# EAGLE design Alimv1 (EAGLE 9.0.1)
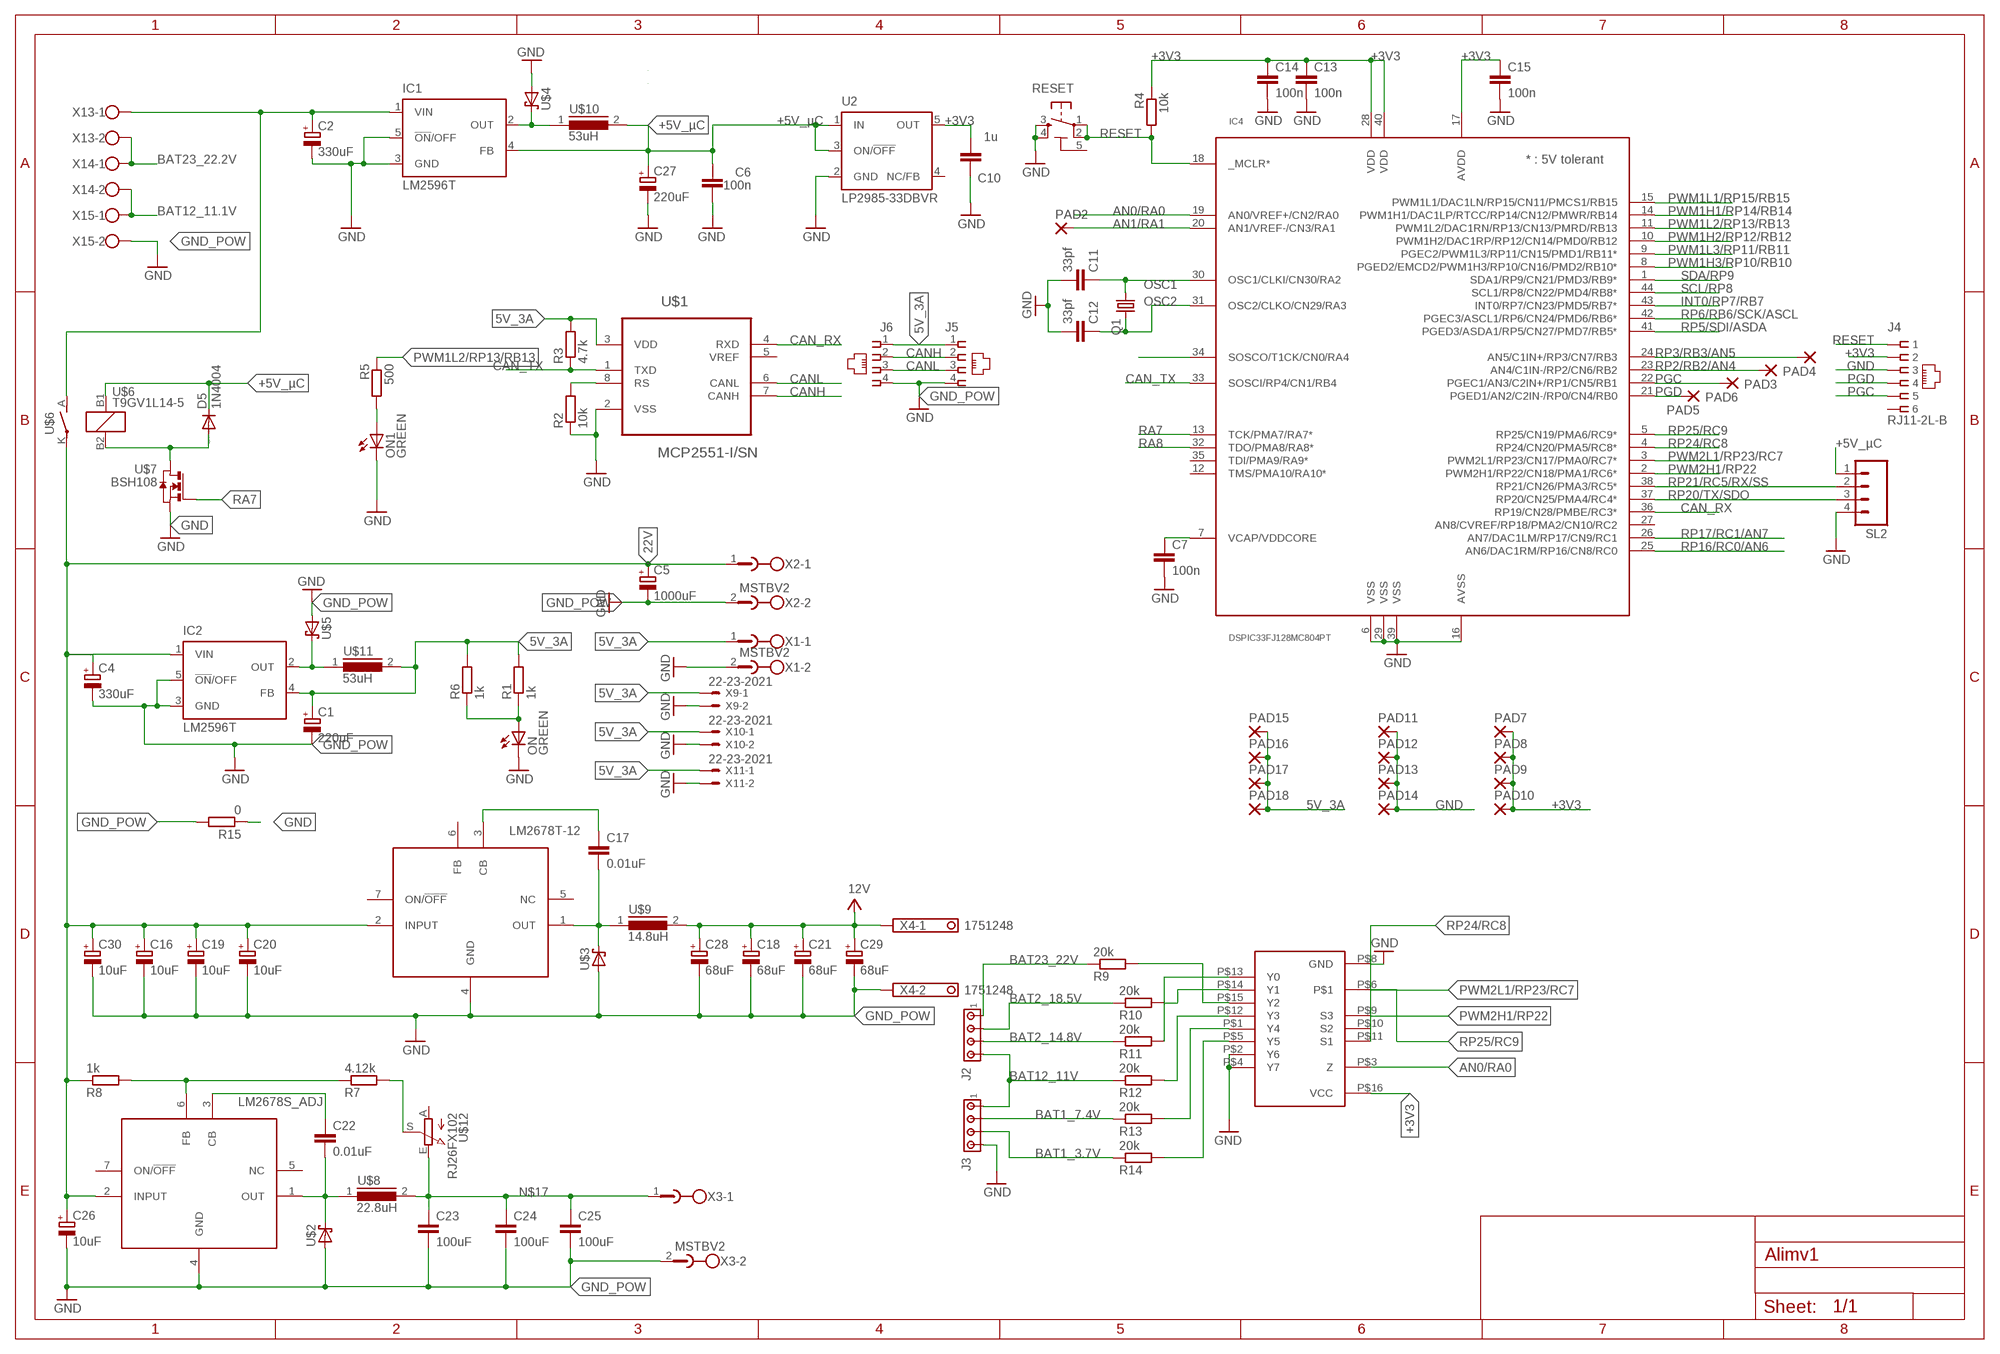
[diagram p0: schematic, sheet 1]

## Parts
C1  220uF  CPOL-EUD/7343-31W  [D/7343-31W]
C2  330uF  CPOL-EUD/7343-31W  [D/7343-31W]
C4  330uF  CPOL-EUD/7343-31W  [D/7343-31W]
C5  1000uF  CPOL-EUE7.5-16  [E7,5-16]
C6  100n  C-EU0603-RND  [C0603-ROUND]
C7  100n  C-EUC0603K  [C0603K]
C10  1u  C-EU0603-RND  [C0603-ROUND]
C11  33pf  C-EUC0603  [C0603]
C12  33pf  C-EUC0603  [C0603]
C13  100n  C-EUC0603  [C0603]
C14  100n  C-EUC0603  [C0603]
C15  100n  C-EUC0603  [C0603]
C16  10uF  CPOL-EUD/7343-31W  [D/7343-31W]
C17  0.01uF  C-EUC0603  [C0603]
C18  68uF  CPOL-EUD/7343-31W  [D/7343-31W]
C19  10uF  CPOL-EUD/7343-31W  [D/7343-31W]
C20  10uF  CPOL-EUD/7343-31W  [D/7343-31W]
C21  68uF  CPOL-EUD/7343-31W  [D/7343-31W]
C22  0.01uF  C-EUC0603  [C0603]
C23  100uF  C-EUC1210  [C1210]
C24  100uF  C-EUC1210  [C1210]
C25  100uF  C-EUC1210  [C1210]
C26  10uF  CPOL-EUD/7343-31W  [D/7343-31W]
C27  220uF  CPOL-EUD/7343-31W  [D/7343-31W]
C28  68uF  CPOL-EUD/7343-31W  [D/7343-31W]
C29  68uF  CPOL-EUD/7343-31W  [D/7343-31W]
C30  10uF  CPOL-EUD/7343-31W  [D/7343-31W]
D5  1N4004  [DO41-10]
IC1  LM2596T  [T05D]
IC2  LM2596T  [T05D]
IC4  DSPIC33FJ128MC804PT  [TQFP44]
J2  MTA04-100  [10X04MTA]
J3  MTA04-100  [10X04MTA]
J4  RJ11-2L-B  [RJ11-NO_SHIELD]
J5  520249-2  [520249-2]
J6  520249-2  [520249-2]
LM2678S_ADJ  LM2678  [TO-220-7]
LM2678T-12  LM2678  [TO-220-7]
ON  GREEN  LEDCHIP-LED0805  [CHIP-LED0805]
ON1  GREEN  LEDCHIP-LED0805  [CHIP-LED0805]
PAD2  1,6/0,9  [1,6/0,9]
PAD3  1,6/0,9  [1,6/0,9]
PAD4  1,6/0,9  [1,6/0,9]
PAD5  1,6/0,9  [1,6/0,9]
PAD6  1,6/0,9  [1,6/0,9]
PAD7  1,6/0,9  [1,6/0,9]
PAD8  1,6/0,9  [1,6/0,9]
PAD9  1,6/0,9  [1,6/0,9]
PAD10  1,6/0,9  [1,6/0,9]
PAD11  1,6/0,9  [1,6/0,9]
PAD12  1,6/0,9  [1,6/0,9]
PAD13  1,6/0,9  [1,6/0,9]
PAD14  1,6/0,9  [1,6/0,9]
PAD15  1,6/0,9  [1,6/0,9]
PAD16  1,6/0,9  [1,6/0,9]
PAD17  1,6/0,9  [1,6/0,9]
PAD18  1,6/0,9  [1,6/0,9]
Q1  CRYSTALSM49  [SM49]
R1  1k  R-EU_R0805  [R0805]
R2  10k  R-EU_R0805  [R0805]
R3  4.7k  R-EU_R0805  [R0805]
R4  10k  R-EU_R0805  [R0805]
R5  500  R-EU_R0805  [R0805]
R6  1k  R-EU_R0805  [R0805]
R7  4.12k  R-EU_R0805  [R0805]
R8  1k  R-EU_R0805  [R0805]
R9  20k  R-EU_R0805  [R0805]
R10  20k  R-EU_R0805  [R0805]
R11  20k  R-EU_R0805  [R0805]
R12  20k  R-EU_R0805  [R0805]
R13  20k  R-EU_R0805  [R0805]
R14  20k  R-EU_R0805  [R0805]
R15  0  R-EU_R0805  [R0805]
RESET  TS42031-160R-TR-7260  TS42  [TS42]
SL2  M04  [04P]
U2  LP2985-33DBVR  LP2985-XXDBVR33  [SOT23-DBV]
U$1  MCP2551-I/SN  [SOIC127P600X175-8N]
U$2  SCHOTTKY_TO220  [TO220ACS]
U$3  SCHOTTKY_TO220  [TO220ACS]
U$4  1N5820  [DO-201AD]
U$5  1N5820  [DO-201AD]
U$6  T9GV1L14-5  [T9G]
U$7  BSH108  [SOT23]
U$8  22.8uH  P0841NL  [KM-3.0]
U$9  14.8uH  P0846NL  [KM-2.1]
U$10  53uH  PE-54039NL  [KM-3.0_5V3A]
U$11  53uH  PE-54039NL  [KM-3.0_5V3A]
U$12  RJ26FX102  [RJ6S]
U$13  NX3L4051PW  [SOT403]
X1  MSTBV2  [MSTBV2]
X2  MSTBV2  [MSTBV2]
X3  MSTBV2  [MSTBV2]
X4  1751248  [1751248]
X9  22-23-2021  [22-23-2021]
X10  22-23-2021  [22-23-2021]
X11  22-23-2021  [22-23-2021]
X13  W237-102  [W237-102]
X14  W237-102  [W237-102]
X15  W237-102  [W237-102]

## Nets
5V_3A: C1.+ IC2.4(FB) J5.1 J6.1 PAD15.1(P) PAD16.1(P) PAD17.1(P) PAD18.1(P) R1.2 R3.2 R6.2 U$1.3(VDD) U$11.2 X1.1 X9.1 X10.1 X11.1
22V: C4.+ C5.+ C16.+ C19.+ C20.+ C26.+ C30.+ IC2.1(VIN) LM2678S_ADJ.2(INPUT) LM2678T-12.2(INPUT) R8.1 U$6.K(P) X2.1
+3V3: C10.2 C13.1 C14.1 C15.1 IC4.17(AVDD) IC4.28(VDD) IC4.40(VDD) J4.2 PAD7.1(P) PAD8.1(P) PAD9.1(P) PAD10.1(P) R4.1 U2.5(OUT) U$13.P$16(VCC)
+5V_µC: C6.2 C27.+ D5.C IC1.4(FB) SL2.1 U2.1(IN) U2.3(ON/!OFF) U$6.B1 U$10.2
AN0/RA0: IC4.19(AN0/VREF+/CN2/RA0) U$13.P$3(Z)
AN1/RA1: IC4.20(AN1/VREF-/CN3/RA1) PAD2.1(P)
BAT1_3.7V: J3.3 R14.1
BAT1_7.4V: J3.2 R13.1
BAT2_14.8V: J2.3 R11.1
BAT2_18.5V: J2.2 R10.1
BAT3+: C2.+ IC1.1(VIN) U$6.A(S) X13.1
BAT12_11.1V: X14.2 X15.1
BAT12_11V: J2.4 J3.1 R12.1
BAT23_22.2V: X13.2 X14.1
BAT23_22V: J2.1 R9.1
CAN_RX: IC4.36(RP19/CN28/PMBE/RC3*) U$1.4(RXD)
CAN_TX: IC4.33(SOSCI/RP4/CN1/RB4) R3.1 U$1.1(TXD)
CANH: J5.2 J6.2 U$1.7(CANH)
CANL: J5.3 J6.3 U$1.6(CANL)
GND: C2.- C6.1 C7.2 C10.1 C11.2 C12.2 C13.2 C14.2 C15.2 C27.- IC1.3(GND) IC1.5(!ON!/OFF) IC4.6(VSS) IC4.16(AVSS) IC4.29(VSS) IC4.39(VSS) J3.4 J4.3 ON1.C ON.C PAD11.1(P) PAD12.1(P) PAD13.1(P) PAD14.1(P) R2.1 R15.1 RESET.3 RESET.4 SL2.4 U2.2(GND) U$1.2(VSS) U$4.A U$7.2(S) U$13.P$2(Y6) U$13.P$4(Y7) U$13.P$8(GND)
GND_POW: C1.- C4.- C5.- C16.- C18.- C19.- C20.- C21.- C23.2 C24.2 C25.2 C26.- C28.- C29.- C30.- IC2.3(GND) IC2.5(!ON!/OFF) J5.4 J6.4 LM2678S_ADJ.4(GND) LM2678T-12.4(GND) R15.2 U$2.A U$3.A U$5.A X1.2 X2.2 X3.2 X4.2 X9.2 X10.2 X11.2 X15.2 ; supply symbol labelled GND
INT0/RP7/RB7: IC4.43(INT0/RP7/CN23/PMD5/RB7*)
N$1: ON1.A R5.2
N$2: ON.A R1.1 R6.1
N$4: R9.2 U$13.P$15(Y2)
N$5: C7.1 IC4.7(VCAP/VDDCORE)
N$6: R11.2 U$13.P$13(Y0)
N$7: LM2678S_ADJ.6(FB) R7.1 R8.2
N$8: R2.2 U$1.8(RS)
N$9: IC2.2(OUT) U$5.C U$11.1
N$10: IC4.34(SOSCO/T1CK/CN0/RA4)
N$11: C17.2 LM2678T-12.1(OUT) U$3.C U$9.1
N$12: IC1.2(OUT) U$4.C U$10.1
N$13: C22.1 LM2678S_ADJ.3(CB)
N$14: C17.1 LM2678T-12.3(CB)
N$15: R12.2 U$13.P$12(Y3)
N$16: C22.2 LM2678S_ADJ.1(OUT) U$2.C U$8.1
N$17: C23.1 C24.1 C25.1 U$8.2 U$12.E X3.1
N$18: D5.A U$6.B2 U$7.3(D)
N$19: R7.2 U$12.S
N$20: R13.2 U$13.P$1(Y4)
N$21: R10.2 U$13.P$14(Y1)
N$22: R14.2 U$13.P$5(Y5)
OSC1: C11.1 IC4.30(OSC1/CLKI/CN30/RA2) Q1.1
OSC2: C12.1 IC4.31(OSC2/CLKO/CN29/RA3) Q1.2
PGC: IC4.22(PGEC1/AN3/C2IN+/RP1/CN5/RB1) J4.5 PAD6.1(P)
PGD: IC4.21(PGED1/AN2/C2IN-/RP0/CN4/RB0) J4.4 PAD5.1(P)
PWM1H1/RP14/RB14: IC4.14(PWM1H1/DAC1LP/RTCC/RP14/CN12/PMWR/RB14)
PWM1H2/RP12/RB12: IC4.10(PWM1H2/DAC1RP/RP12/CN14/PMD0/RB12)
PWM1H3/RP10/RB10: IC4.8(PGED2/EMCD2/PWM1H3/RP10/CN16/PMD2/RB10*)
PWM1L1/RP15/RB15: IC4.15(PWM1L1/DAC1LN/RP15/CN11/PMCS1/RB15)
PWM1L2/RP13/RB13: IC4.11(PWM1L2/DAC1RN/RP13/CN13/PMRD/RB13) R5.1
PWM1L3/RP11/RB11: IC4.9(PGEC2/PWM1L3/RP11/CN15/PMD1/RB11*)
PWM2H1/RP22: IC4.2(PWM2H1/RP22/CN18/PMA1/RC6*) U$13.P$9(S3)
PWM2L1/RP23/RC7: IC4.3(PWM2L1/RP23/CN17/PMA0/RC7*) U$13.P$10(S2)
RA7: IC4.13(TCK/PMA7/RA7*) U$7.1(G)
RA8: IC4.32(TDO/PMA8/RA8*)
RESET: IC4.18(_MCLR*) J4.1 R4.2 RESET.1 RESET.2
RP2/RB2/AN4: IC4.23(AN4/C1IN-/RP2/CN6/RB2) PAD3.1(P)
RP3/RB3/AN5: IC4.24(AN5/C1IN+/RP3/CN7/RB3) PAD4.1(P)
RP5/SDI/ASDA: IC4.41(PGED3/ASDA1/RP5/CN27/PMD7/RB5*)
RP6/RB6/SCK/ASCL: IC4.42(PGEC3/ASCL1/RP6/CN24/PMD6/RB6*)
RP16/RC0/AN6: IC4.25(AN6/DAC1RM/RP16/CN8/RC0)
RP17/RC1/AN7: IC4.26(AN7/DAC1LM/RP17/CN9/RC1)
RP20/TX/SDO: IC4.37(RP20/CN25/PMA4/RC4*) SL2.3
RP21/RC5/RX/SS: IC4.38(RP21/CN26/PMA3/RC5*) SL2.2
RP24/RC8: IC4.4(RP24/CN20/PMA5/RC8*) U$13.P$11(S1)
RP25/RC9: IC4.5(RP25/CN19/PMA6/RC9*) U$13.P$6
SCL/RP8: IC4.44(SCL1/RP8/CN22/PMD4/RB8*)
SDA/RP9: IC4.1(SDA1/RP9/CN21/PMD3/RB9*)
V+: C18.+ C21.+ C28.+ C29.+ U$9.2 X4.1 ; supply symbol labelled 12V
Unconnected: IC4.12(TMS/PMA10/RA10*) IC4.27(AN8/CVREF/RP18/PMA2/CN10/RC2) IC4.35(TDI/PMA9/RA9*) J4.6 LM2678S_ADJ.5(NC) LM2678S_ADJ.7(ON/!OFF!) LM2678T-12.5(NC) LM2678T-12.6(FB) LM2678T-12.7(ON/!OFF!) U2.4(NC/FB) U$1.5(VREF) U$12.A

## Power pins joined to a net without a drawn wire
5-GND: RESET.5(5-GND)

## Library data of the parts
C1 C27 = rcl:CPOL-EU: POLARIZED CAPACITOR, European symbol; OC_FARNELL: 2283872; SPICEPREFIX: C
C2 C4 = rcl:CPOL-EU: POLARIZED CAPACITOR, European symbol; OC_FARNELL: 1135198; SPICEPREFIX: C
C5 = rcl:CPOL-EU: POLARIZED CAPACITOR, European symbol; SPICEPREFIX: C
C6 C7 = SmartPrj:C-EU: CAPACITOR, European symbol; OC_FARNELL: 2210925
C10 = SmartPrj:C-EU: CAPACITOR, European symbol; OC_FARNELL: 2346901
C11 C12 = LibPerso:C-EU: CAPACITOR, European symbol; OC_FARNELL: 1740598
C13-C15 = LibPerso:C-EU: CAPACITOR, European symbol; OC_FARNELL: 2210925
C16 C19 C20 C30 = rcl:CPOL-EU: POLARIZED CAPACITOR, European symbol; OC_FARNELL: 2424754; SPICEPREFIX: C
C17 C22 = rcl:C-EU: CAPACITOR, European symbol; SPICEPREFIX: C
C18 C21 C28 C29 = rcl:CPOL-EU: POLARIZED CAPACITOR, European symbol; OC_FARNELL: 2524603; SPICEPREFIX: C
C23-C25 = rcl:C-EU: CAPACITOR, European symbol; OC_FARNELL: 1658510; SPICEPREFIX: C
C26 = rcl:CPOL-EU: POLARIZED CAPACITOR, European symbol; OC_FARNELL: 1432608; SPICEPREFIX: C
D5 = diode:1N4004: DIODE general purpose rectifier, 1 A
IC1 IC2 = national-semiconductor:LM2596: SIMPLE SWITCHER® Power Converter 150 kHz 3A Step-Down Voltage Regulator Source: http://www.national.com/ds/LM/LM2596.pdf; MPN: LM2596T-ADJ/LF02; OC_FARNELL: 9494162; OC_NEWARK: 65K5910
IC4 = microchip-dspic33:DSPIC33F*04
J2 J3 = con-amp:MTA04-100: AMP connector
J4 = LibPerso:RJ11: CORCOM Modular RJ Jacks No Shield Source: www.tycoelectronics.com .. ENG_DS_1654001_1099_RJ_L_0507.pdf; MF: TYCO ELECTRONICS; MPN: RJ11-2L-B; OC_FARNELL: 1393306; OC_NEWARK: 83F4463
J5 J6 = LibPerso:520249-2: AMP connector; OC_FARNELL: 1137972; OC_RS: 477-359
LM2678S_ADJ = Robot_MT:LM2678; OC_FARNELL: 9778357; SPICEPREFIX: X
LM2678T-12 = Robot_MT:LM2678; OC_FARNELL: 9778357
ON ON1 = led:LED: LED OSRAM: - CHIPLED LG R971, LG N971, LY N971, LG Q971, LY Q971, LO R971, LY R971 LH N974, LH R974 LS Q976, LO Q976, LY Q976 LO Q996 - Hyper CHIPLED LW Q18S LB Q993, LB Q99A, LB R99A - SideLED LS A670, LO A670, LY A670, LG A670, LP A670 LB A673, LV A673, LT A673, LW A673 LH A674 LY A675 LS A676, LA A676, LO A676, LY A676, LW A676 LS A679, LY A679, LG A679 - Hyper Micro SIDELED® LS Y876, LA Y876, LO Y876, LY Y876 LT Y87S - SmartLED LW L88C, LW L88S LB L89C, LB L89S, LG L890 LS L89K, LO L89K, LY L89K LS L896, LA L896, LO L896, LY L896 - TOPLED LS T670, LO T670, LY T670, LG T670, LP T670 LSG T670, LSP T670, LSY T670, LOP T670, LYG T670 LG T671, LOG T671, LSG T671 LB T673, LV T673, LT T673, LW T673 LH T674 LS T676, LA T676, LO T676, LY T676, LB T676, LH T676, LSB T676, LW T676 LB T67C, LV T67C, LT T67C, LS T67K, LO T67K, LY T67K, LW E67C LS E67B, LA E67B, LO E67B, LY E67B, LB E67C, LV E67C, LT E67C LW T67C LS T679, LY T679, LG T679 LS T770, LO T770, LY T770, LG T770, LP T770 LB T773, LV T773, LT T773, LW T773 LH T774 LS E675, LA E675, LY E675, LS T675 LS T776, LA T776, LO T776, LY T776, LB T776 LHGB T686 LT T68C, LB T68C - Hyper Mini TOPLED® LB M676 - Mini TOPLED Santana® LG M470 LS M47K, LO M47K, LY M47K Source: http://www.osram.convergy.de LUXEON: - LUMILED® LXK2-PW12-R00, LXK2-PW12-S00, LXK2-PW14-U00, LXK2-PW14-V00 LXK2-PM12-R00, LXK2-PM12-S00, LXK2-PM14-U00 LXK2-PE12-Q00, LXK2-PE12-R00, LXK2-PE12-S00, LXK2-PE14-T00, LXK2-PE14-U00 LXK2-PB12-K00, LXK2-PB12-L00, LXK2-PB12-M00, LXK2-PB14-N00, LXK2-PB14-P00, LXK2-PB14-Q00 LXK2-PR12-L00, LXK2-PR12-M00, LXK2-PR14-Q00, LXK2-PR14-R00 LXK2-PD12-Q00, LXK2-PD12-R00, LXK2-PD12-S00 LXK2-PH12-R00, LXK2-PH12-S00 LXK2-PL12-P00, LXK2-PL12-Q00, LXK2-PL12-R00 Source: www.luxeon.com KINGBRIGHT: KA-3528ASYC Source: www.kingbright.com; OC_FARNELL: 8529906
PAD2-PAD18 = wirepad:1,6/0,9: THROUGH-HOLE PAD
Q1 = crystal:CRYSTAL: CRYSTAL; OC_FARNELL: 1842332; OC_NEWARK: unknown
R1-R4 R6 R9-R15 = LibPerso:R-EU_: RESISTOR, European symbol
R5 R7 R8 = resistor:R-EU_: RESISTOR, European symbol
RESET = SmartPrj:TS42: TS42 Dongnan Electronics Tact switch VDC 12V - 50mA; OC_FARNELL: 2060823
SL2 = con-amp-quick:M04: AMP QUICK CONNECTOR; OC_FARNELL: unknown; OC_NEWARK: unknown
U2 = SmartPrj:LP2985-XXDBVR: ULTRALOW-POWER 50-mA LOW-DROPOUT LINEAR REGULATORS 50-mA Low-Dropout Regulator Source: http://focus.ti.com/lit/ds/symlink/tps77001.pdf; OC_FARNELL: 2395925
U$1 = LibPerso:MCP2551-I/SN: High-Speed CAN Transceiver; MPN: MCP2551-I/SN; OC_FARNELL: 9758569; OC_NEWARK: 69K7604; PACKAGE: SOIC-8; SUPPLIER: Microchip
U$2 = Robot_MT:SCHOTTKY_TO220; OC_FARNELL: 2677696
U$3 = Robot_MT:SCHOTTKY_TO220; OC_FARNELL: 9557296
U$4 U$5 = Robot_MT:1N5820; OC_FARNELL: 1017590
U$6 = Robot_MT:T9GV1L14-5; OC_FARNELL: 2857449
U$7 = Robot_MT:BSH108
U$8 = Robot_MT:P0841NL; OC_FARNELL: 2215927
U$9 = Robot_MT:P0846NL; OC_FARNELL: 2215928
U$10 U$11 = Robot_MT:PE-54039NL; OC_FARNELL: 2215963
U$12 = Robot_MT:RJ26FX102
U$13 = Robot_MT:NX3L4051PW; OC_FARNEL: 2775927
X1-X3 = con-phoenix-508:MSTBV2: PHOENIX; MPN: MSTBV 2,5/2-GF-5.08; OC_FARNELL: 1792792; OC_NEWARK: 69R9845
X4 = con-phoenix-350:1751248: MKDS 1/ 2-3,5 Printklemme Nennstrom: 10 A Bemessungsspannung: 160 V Raster: 3,5 mm Polzahl: 2 Montageart: Löten Anschlussart: Schraubanschluss Anschlussrichtung vom Leiter zur Platine: 0° Source: http://eshop.phoenixcontact.com .. 1751248.pdf; OC_FARNELL: unknown; OC_NEWARK: unknown
X9-X11 = con-molex:22-23-2021: .100" (2.54mm) Center Header - 2 Pin; MF: MOLEX; MPN: 22-23-2021; OC_FARNELL: 1462926; OC_NEWARK: 25C3832
X13-X15 = con-wago-500:W237-102: WAGO SCREW CLAMP; MPN: 237-102; OC_FARNELL: unknown; OC_NEWARK: 70K9898

## Net classes
0 default: width 0.254 mm, clearance 0.254 mm

## Board
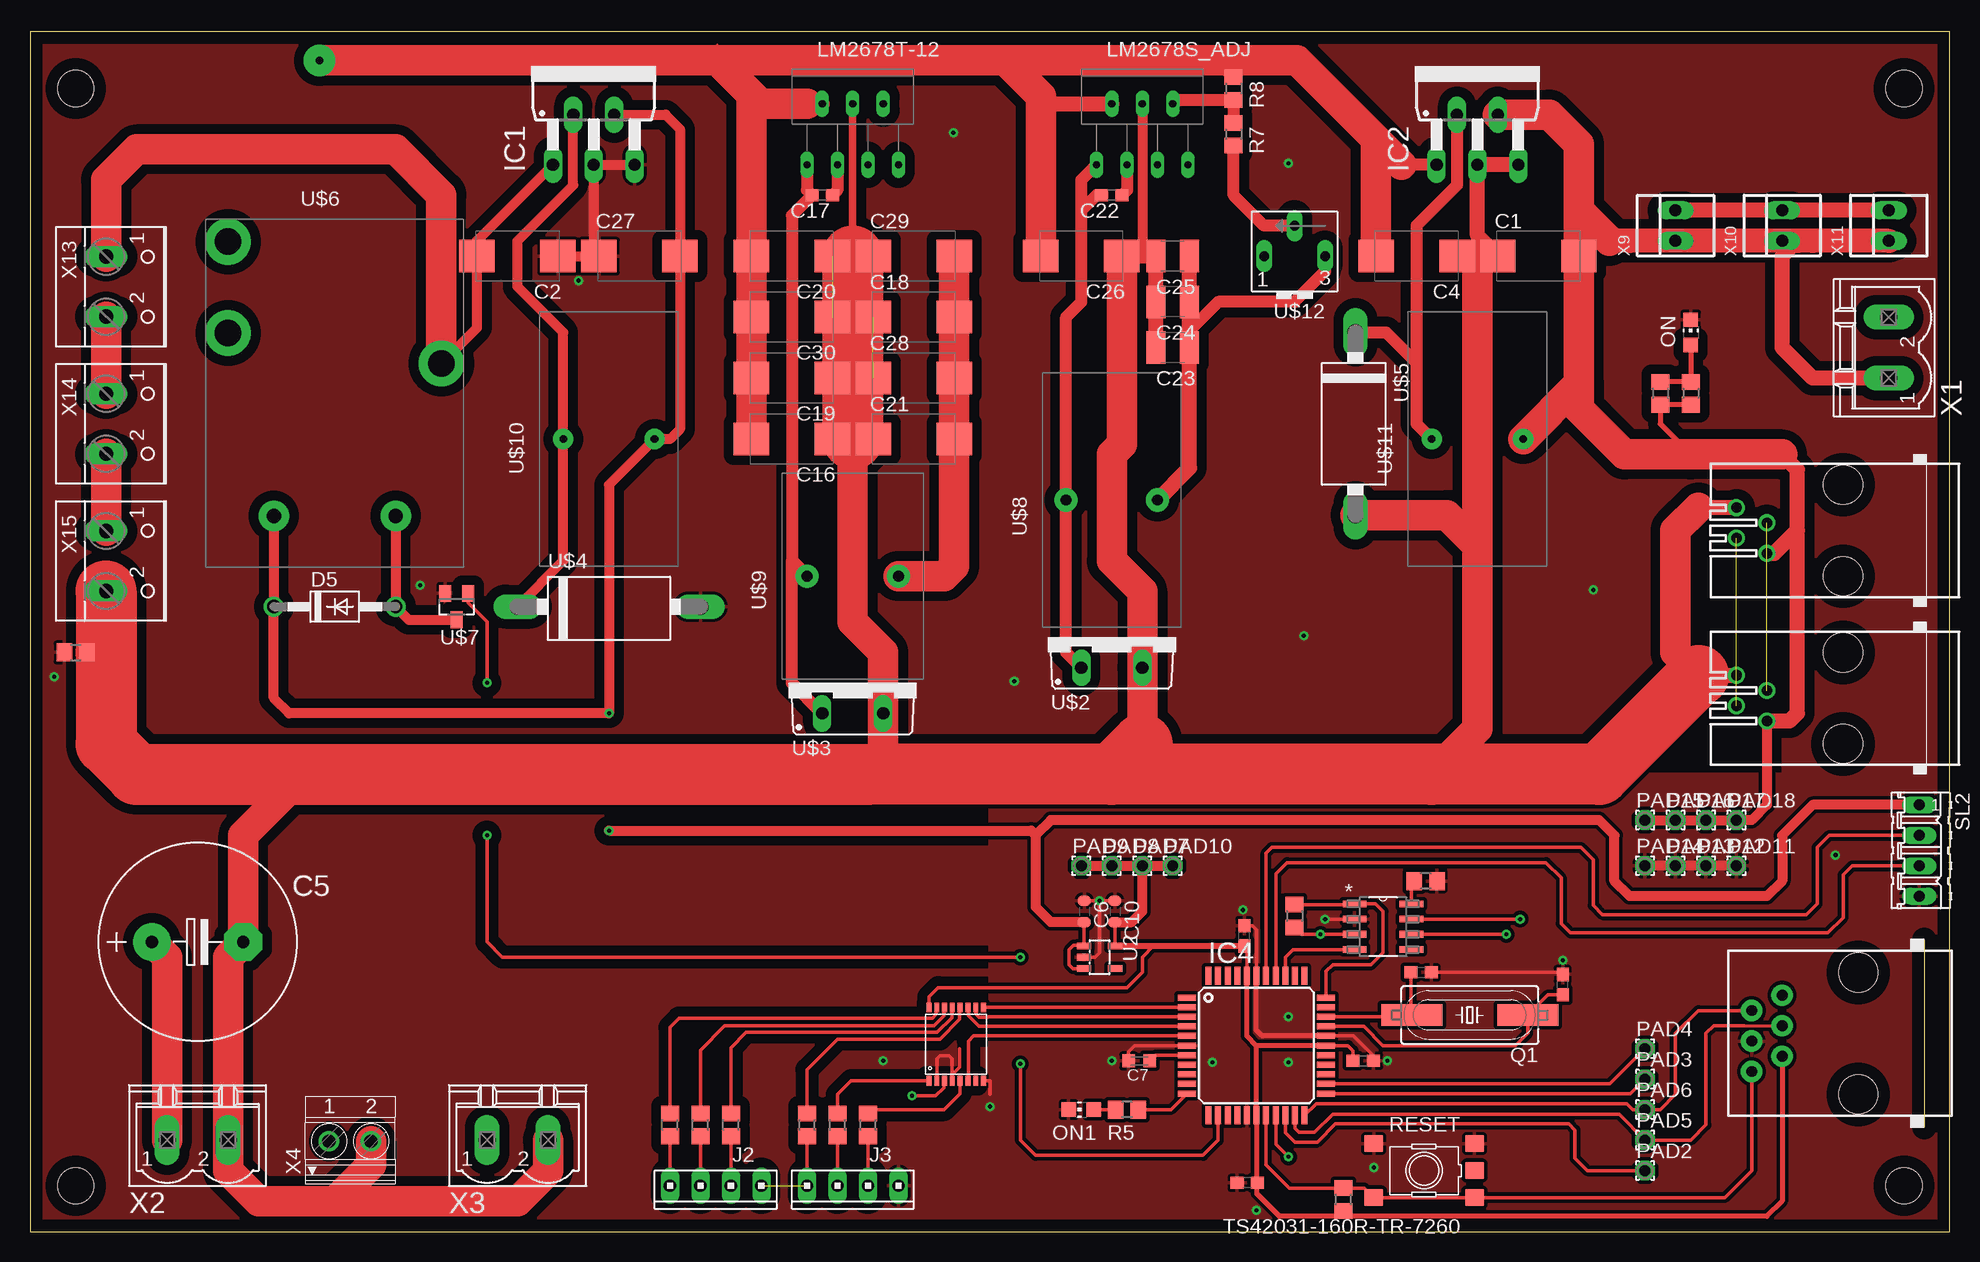
[diagram p1: board, top side]
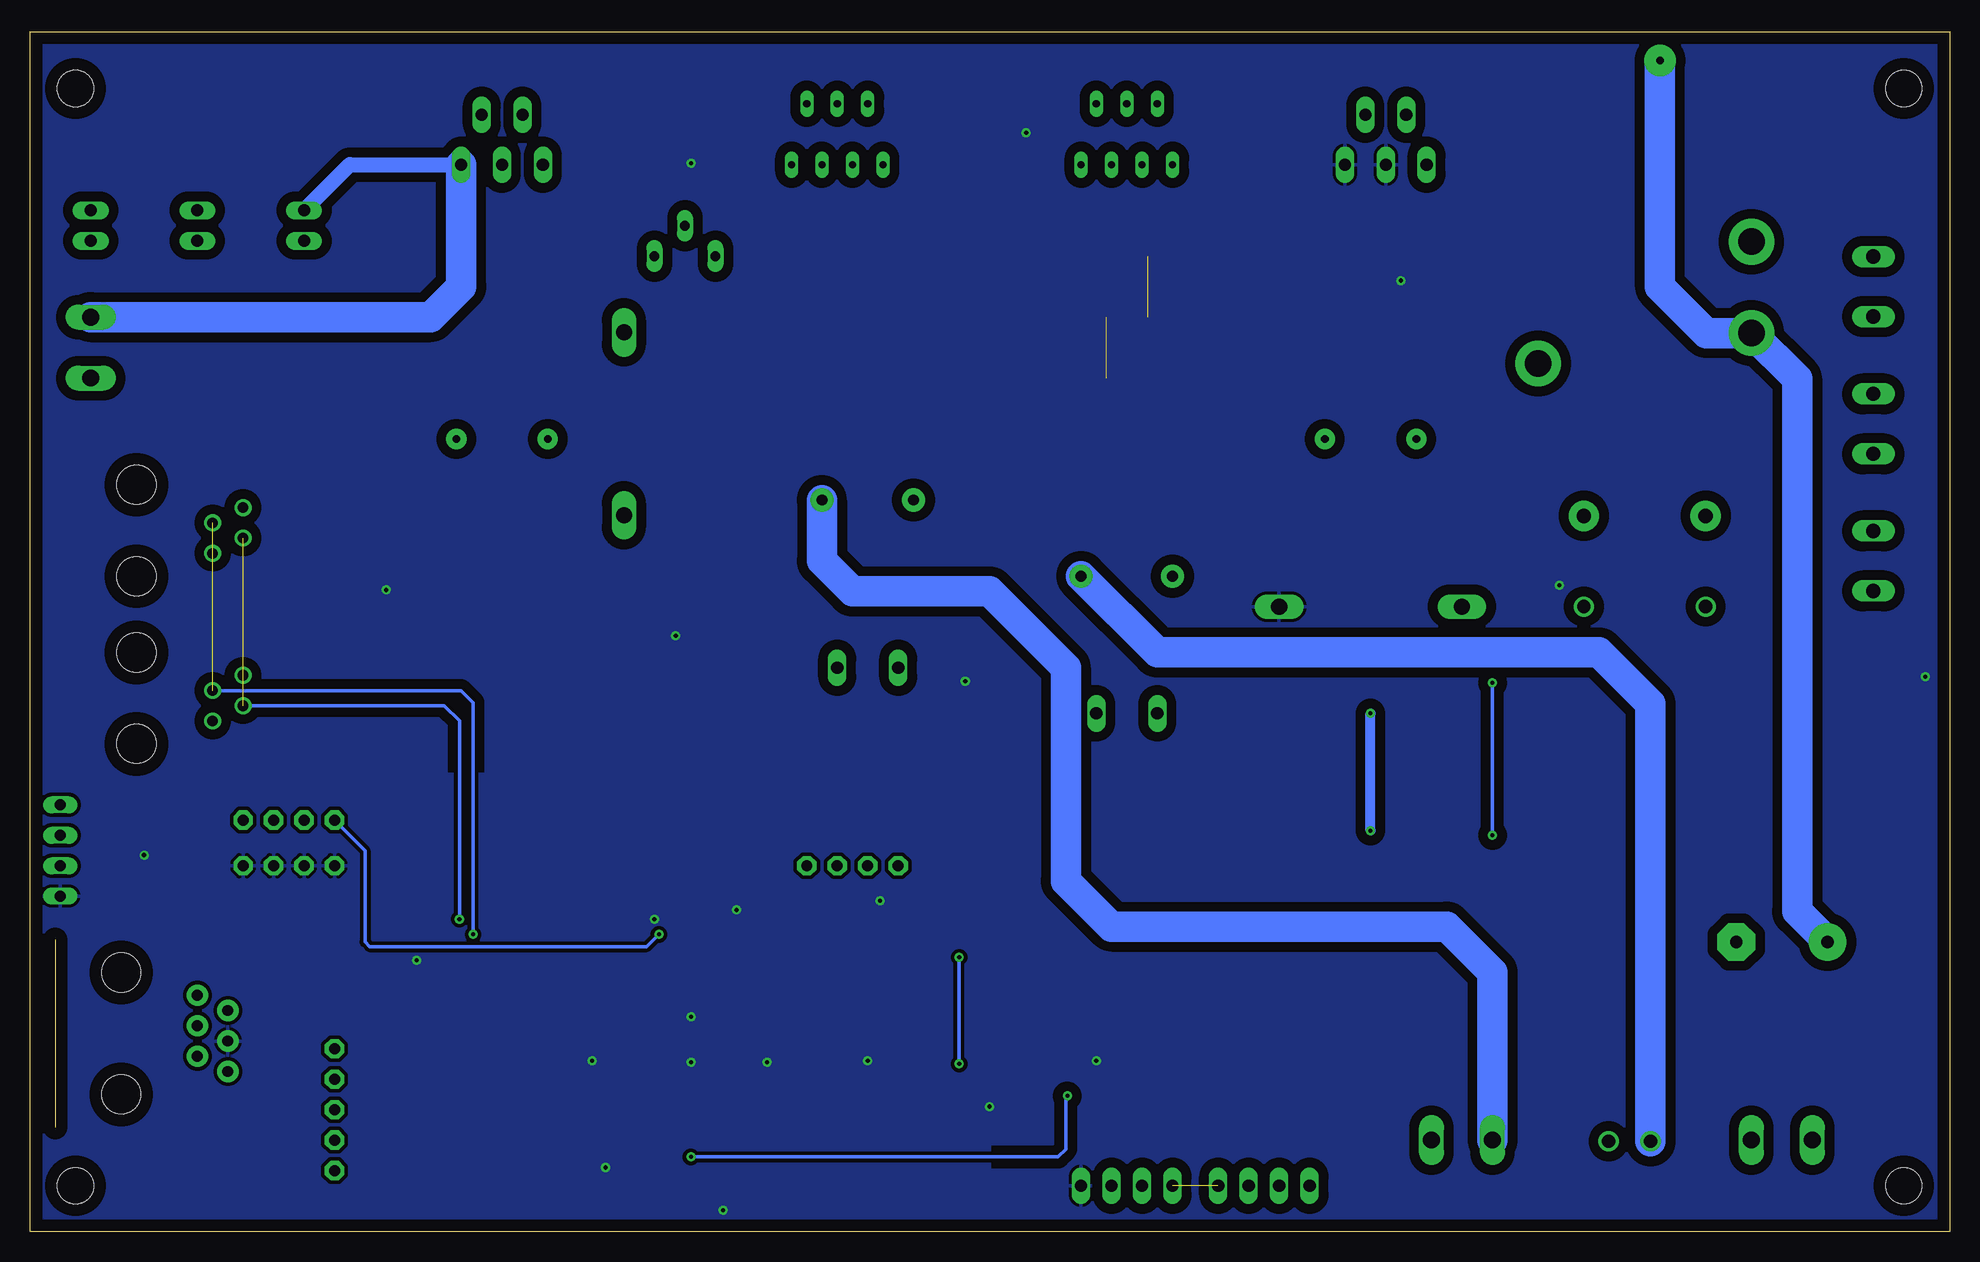
[diagram p2: board, bottom side, seen from below]

Size 160 x 100 mm. Coordinates in mm from the lower left corner, seen from the top.
Outline: 0,0 160,0 160,100 0,100 0,0
Copper layers (1*16): Top 0.035mm / dielectric 1.5mm / Bottom 0.035mm
Design rules "default": minimum track width 6mil, minimum drill 0.35mm, track to track 6mil, track to pad 6mil, pad to pad 6mil, via to via 6mil, smd to smd 6mil, copper to edge 40mil, drill to drill 6mil, minimum pad ring 10mil, minimum via ring 8mil, stop-mask expansion 4mil, vias tented up to drill 0mil, thermal gap 10mil
Holes 3 mm at 3.81,3.81 156.21,3.81 156.21,95.25 3.81,95.25

### Footprints (pad centres in the part's own frame; a part is rotated, then mirrored left to right if it is on the bottom)
D/7343-31W = smd 2.95 x 2.7: + 3.375,0; - -3.375,0
E7,5-16 = drill 1.016 pad 3.15: + -3.81,0 | drill 1.016 pad 3.15 octagon: - 3.81,0
C0603-ROUND = smd 0.898 x 1.1: 1 -0.889,0; 2 0.889,0
C0603K = smd 1.05 x 1.08: 1 -0.875,0; 2 0.875,0
C0603 = smd 1.1 x 1: 1 -0.85,0; 2 0.85,0
C1210 = smd 1.6 x 2.7: 1 -1.4,0; 2 1.4,0
DO41-10 = drill 1.118: A 5.08,0; C -5.08,0
T05D = drill 1.016 long: 1 -3.404,-5.08; 2 -1.702,-0.914; 3 0,-5.08; 4 1.702,-0.914; 5 3.404,-5.08
TQFP44 = smd 1.5 x 0.5: 1 -5.8,4; 2 -5.8,3.2; 3 -5.8,2.4; 4 -5.8,1.6; 5 -5.8,0.8; 6 -5.8,0; 7 -5.8,-0.8; 8 -5.8,-1.6; 9 -5.8,-2.4; 10 -5.8,-3.2; 11 -5.8,-4; 23 5.8,-4; 24 5.8,-3.2; 25 5.8,-2.4; 26 5.8,-1.6; 27 5.8,-0.8; 28 5.8,0; 29 5.8,0.8; 30 5.8,1.6; 31 5.8,2.4; 32 5.8,3.2; 33 5.8,4 | smd 0.5 x 1.5: 12 -4,-5.8; 13 -3.2,-5.8; 14 -2.4,-5.8; 15 -1.6,-5.8; 16 -0.8,-5.8; 17 0,-5.8; 18 0.8,-5.8; 19 1.6,-5.8; 20 2.4,-5.8; 21 3.2,-5.8; 22 4,-5.8; 34 4,5.8; 35 3.2,5.8; 36 2.4,5.8; 37 1.6,5.8; 38 0.8,5.8; 39 0,5.8; 40 -0.8,5.8; 41 -1.6,5.8; 42 -2.4,5.8; 43 -3.2,5.8; 44 -4,5.8
10X04MTA = drill 1.016 long: 1 3.81,0; 2 1.27,0; 3 -1.27,0; 4 -3.81,0
RJ11-NO_SHIELD = drill 0.9 pad 1.778: 1 -3.175,8.89; 2 -1.905,6.35; 3 -0.635,8.89; 4 0.635,6.35; 5 1.905,8.89; 6 3.175,6.35 | hole 3.251: -5.08,0; 5.08,0
520249-2 = drill 0.889: 1 -1.905,6.35; 2 -0.635,8.89; 3 0.635,6.35; 4 1.905,8.89 | hole 3.251: -3.81,0; 3.81,0
TO-220-7 = drill 0.6 long: 1 -3.81,-5.08; 2 -2.54,0; 3 -1.27,-5.08; 4 0,0; 5 1.27,-5.08; 6 2.54,0; 7 3.81,-5.08
CHIP-LED0805 = smd 1.2 x 1.2: A 0,-1.05; C 0,1.05
1,6/0,9 = drill 0.914 pad 1.6 octagon: 1 0,0
SM49 = smd 5.08 x 1.778: 1 -4.826,0; 2 4.826,0
R0805 = smd 1.3 x 1.5: 1 -0.95,0; 2 0.95,0
TS42 = smd 1.6 x 1.4: 1 -4.2,2.25; 2 4.2,2.25; 3 -4.2,-2.25; 4 4.2,-2.25; 5 -4.2,0
04P = drill 0.914 long: 1 -3.81,0; 2 -1.27,0; 3 1.27,0; 4 3.81,0
SOT23-DBV = smd 0.55 x 1.2: 1 -0.95,-1.3; 2 0,-1.3; 3 0.95,-1.3; 4 0.95,1.3; 5 -0.95,1.3
SOIC127P600X175-8N = smd 1.981 x 0.559: 1 -2.362,1.905; 2 -2.362,0.635; 3 -2.362,-0.635; 4 -2.362,-1.905; 5 2.362,-1.905; 6 2.362,-0.635; 7 2.362,0.635; 8 2.362,1.905
TO220ACS = drill 1.016 long: A 2.54,-2.54; C -2.54,-2.54
DO-201AD = drill 1.35 long: A 7.62,0; C -7.62,0
T9G = drill 2.2 pad 3.81: A 8.89,2.48; F -8.89,12.64; K -8.89,5.02 | drill 1.2 pad 2.54: B1 -5.08,-10.22; B2 5.08,-10.22
SOT23 = smd 1 x 1.4: 1 -0.95,-1.1; 2 0.95,-1.1; 3 0,1.1
KM-3.0 = drill 0.9 pad 1.93: 1 0,3.81; 2 0,-3.81
KM-2.1 = drill 0.9 pad 1.93: 1 0,3.81; 2 0,-3.81
KM-3.0_5V3A = drill 0.65 pad 1.676: 1 0,3.81; 2 0,-3.81
RJ6S = drill 0.813 long: A 2.54,0; E -2.54,0; S 0,-2.54
SOT403 = smd 0.406 x 0.813: P$1 0,-0.127; P$2 0.65,-0.127; P$3 1.3,-0.127; P$4 1.95,-0.127; P$5 2.6,-0.127; P$6 3.25,-0.127; P$7 3.9,-0.127; P$8 4.55,-0.127; P$9 4.55,5.977; P$10 3.9,5.977; P$11 3.25,5.977; P$12 2.6,5.977; P$13 1.95,5.977; P$14 1.3,5.977; P$15 0.65,5.977; P$16 0,5.977
MSTBV2 = drill 1.397 long: 1 -2.54,0; 2 2.54,0
1751248 = drill 1.1 pad 1.7: 1 -1.75,-0.1; 2 1.75,-0.1
22-23-2021 = drill 1 long: 1 -1.27,0; 2 1.27,0
W237-102 = drill 1.194 long: 1 -2.5,-1.27; 2 2.5,-1.27

### Placement (x,y rotation side)
C1  125.73,81.28 0 top
C2  40.64,81.28 180 top
C4  115.57,81.28 180 top
C5  13.97,24.13 0 top
C6  87.88,26.67 270 top
C7  92.46,14.22 180 top
C10  90.42,26.67 270 top
C11  127.76,20.57 90 top
C12  115.95,21.59 0 top
C13  111.12,14.22 0 top
C14  101.47,4.06 180 top
C15  101.22,24.64 90 top
C16  63.5,66.04 180 top
C17  66.04,86.36 180 top
C18  73.66,76.2 0 top
C19  63.5,71.12 180 top
C20  63.5,81.28 180 top
C21  73.66,66.04 0 top
C22  90.17,86.36 180 top
C23  95.25,73.66 180 top
C24  95.25,77.47 180 top
C25  95.25,81.28 180 top
C26  87.63,81.28 180 top
C27  50.8,81.28 0 top
C28  73.66,71.12 0 top
C29  73.66,81.28 0 top
C30  63.5,76.2 180 top
D5  25.4,52.07 0 top
IC1  46.99,93.98 0 top
IC2  120.65,93.98 0 top
IC4  102.23,15.49 0 top
J2  57.15,3.81 180 top
J3  68.58,3.81 180 top
J4  152.4,16.51 90 top
J5  151.13,44.45 90 top
J6  151.13,58.42 90 top
LM2678S_ADJ  92.71,93.98 0 top
LM2678T-12  68.58,93.98 0 top
ON  138.43,74.93 0 top
ON1  87.63,10.16 90 top
PAD2  134.62,5.08 0 top
PAD3  134.62,12.7 0 top
PAD4  134.62,15.24 0 top
PAD5  134.62,7.62 0 top
PAD6  134.62,10.16 0 top
PAD7  92.71,30.48 0 top
PAD8  90.17,30.48 0 top
PAD9  87.63,30.48 0 top
PAD10  95.25,30.48 0 top
PAD11  142.24,30.48 0 top
PAD12  139.7,30.48 0 top
PAD13  137.16,30.48 0 top
PAD14  134.62,30.48 0 top
PAD15  134.62,34.29 0 top
PAD16  137.16,34.29 0 top
PAD17  139.7,34.29 0 top
PAD18  142.24,34.29 0 top
Q1  120.02,18.03 180 top
R1  135.89,69.85 270 top
R2  116.33,29.21 180 top
R3  105.41,26.29 270 top
R4  109.47,2.67 90 top
R5  91.44,10.16 180 top
R6  138.43,69.85 270 top
R7  100.33,91.44 270 top
R8  100.33,95.25 270 top
R9  53.34,8.89 90 top
R10  55.88,8.89 90 top
R11  58.42,8.89 90 top
R12  64.77,8.89 90 top
R13  67.31,8.89 90 top
R14  69.85,8.89 90 top
R15  3.81,48.26 0 top
RESET  116.2,5.08 180 top
SL2  157.48,31.75 270 top
U2  89.15,22.86 270 top
U$1  112.78,25.4 0 top
U$2  90.17,49.53 0 top
U$3  68.58,45.72 0 top
U$4  48.26,52.07 0 top
U$5  110.49,67.31 270 top
U$6  25.4,69.85 0 top
U$7  35.56,52.07 180 top
U$8  90.17,60.96 90 top
U$9  68.58,54.61 90 top
U$10  48.26,66.04 90 top
U$11  120.65,66.04 90 top
U$12  105.41,81.28 180 top
U$13  74.93,12.7 0 top
X1  154.94,73.66 90 top
X2  13.97,7.62 0 top
X3  40.64,7.62 0 top
X4  26.67,7.62 0 top
X9  137.16,83.82 90 top
X10  146.05,83.82 90 top
X11  154.94,83.82 90 top
X13  7.62,78.74 270 top
X14  7.62,67.31 270 top
X15  7.62,55.88 270 top

### Tracks (layer width: path | path; a pad name or v marks a point on that pad's centre or on a via)
5V_3A  (via drill 0.35)
  Top 0.305: U$1.3 v107.57,24.77 105.98,24.77 R3.2
  Top 0.406: R6.2 R1.2 135.89,67.31 138.43,64.77
  Top 0.813: PAD15.1 PAD16.1 PAD17.1 PAD18.1 143.51,34.29 144.78,35.56 J5.1
  Top 1.27: J5.1 146.69,42.55 147.32,43.18 147.32,58.42 | J6.1 145.41,56.52 147.32,58.42 | 146.05,64.77 147.32,63.5 147.32,58.42 | X10.1 147.32,82.55 146.05,81.28 146.05,73.66 148.59,71.12 X1.1 | X9.1 133.35,82.55
  Top 2: X11.1 148.59,82.55 147.32,82.55 133.35,82.55 131.65,82.55
  Top 2.54: IC2.4 126.64,93.07 129.1,90.61 129.1,85.09 | 129.1,85.09 C1.+ 129.1,70.69 | U$11.2 129.1,70.69 | 129.1,70.69 129.1,68.58 132.91,64.77 138.43,64.77 146.05,64.77 | 131.65,82.55 129.1,85.09
  Bottom 0.305: PAD15.1 132.08,31.75 132.08,24.13 131.7,23.75 108.58,23.75 v107.57,24.77
22V  (via drill 0.6 pad 2.6)
  Top 0.152: 57.28,97.59 57.28,98.91
  Top 1.016: IC2.1 114.3,88.9 | 84.25,94.61 84.89,93.98 | R8.1 98.94,97.59
  Top 1.27: LM2678T-12.2 64.77,93.98 | 84.89,93.98 LM2678S_ADJ.2
  Top 2.54: C16.+ C19.+ C30.+ C20.+ 60.12,94.74 | C4.+ 112.19,91 | 114.3,88.9 112.19,91 | 60.12,94.74 57.28,97.59 | 64.77,93.98 60.88,93.98 60.12,94.74 | C26.+ 84.25,94.61 81.28,97.59 | 57.28,97.59 81.28,97.59 | v24.13,97.59 57.28,97.59 | 81.28,97.59 98.94,97.59 105.61,97.59 112.19,91 | X2.1 11.43,22.86 C5.+
  Bottom 2.54: v24.13,97.59 24.13,78.74 20.26,74.87 U$6.K 12.7,71.06 12.7,26.67 C5.+
+3V3
  Top 0.305: IC4.28 109.86,15.49 110.28,15.07 C13.1 | C15.1 101.44,23.5 101.44,21.34 IC4.40 | C10.2 90.42,23.84 U2.5 | U$13.P$16 74.93,19.56 75.69,20.32 91.44,20.32 92.71,21.59 92.71,22.86 93.66,23.81 93.98,23.81
  Top 0.406: IC4.28 102.23,15.49 | 101.44,21.34 101.44,16.29 102.23,15.49 | 102.23,15.49 IC4.17 102.23,3.81 | 102.23,3.81 102.23,3.17 104.14,1.27 109.03,1.27 | J4.2 146.05,2.54 144.78,1.27 109.03,1.27 | 102.23,3.81 102.26,3.79 102.32,3.79 | R4.1 109.03,1.27
  Top 0.508: U2.5 93.98,23.81 101.2,23.81 C15.1 | 102.32,3.79 C14.1
  Top 0.813: PAD9.1 PAD8.1 PAD7.1 | PAD7.1 PAD10.1 | C10.2 91.82,25.78 92.71,26.67 PAD7.1
+5V_µC  (via drill 0.35)
  Top 0.305: C6.2 87.85,25.75 U2.1 87.79,23.88 87,23.88 86.61,23.5 86.61,22.23 86.93,21.91 U2.3
  Top 0.813: IC1.4 52.98,93.07 54.17,91.88 C27.+ 54.17,66.88 53.34,66.04 U$10.2 48.26,62.23 v48.26,43.18 21.59,43.18 20.32,44.45 D5.C U$6.B1 | C6.2 85.09,25.78 83.82,27.05 83.82,33.02 | SL2.1 148.59,35.56 146.05,33.02 146.05,29.21 144.78,27.94 133.35,27.94 132.08,29.21 132.08,33.02 130.81,34.29 85.09,34.29 83.82,33.02 | v48.26,33.4 83.44,33.4 83.82,33.02
  Bottom 0.813: v48.26,33.4 v48.26,43.18
AN0/RA0  (via drill 0.35)
  Top 0.305: IC4.19 103.83,7.29 v104.9,6.22 | U$13.P$3 76.19,12.53 76.19,12 75.49,11.3 v73.53,11.3
  Bottom 0.305: v104.9,6.22 74.3,6.22 73.66,6.86 73.66,11.18 v73.53,11.3
AN1/RA1
  Top 0.305: IC4.20 104.65,9.55 104.65,8.22 105.43,7.44 107.29,7.44 108.82,8.97 128.27,8.97 128.78,8.46 128.78,6.1 129.79,5.08 PAD2.1
BAT1_3.7V
  Top 0.305: J3.3 R14.1
BAT1_7.4V
  Top 0.305: J3.2 R13.1
BAT2_14.8V
  Top 0.305: J2.3 R11.1
BAT2_18.5V
  Top 0.305: J2.2 R10.1
BAT3+
  Top 0.813: IC1.1 37.27,82.58 C2.+ 37.27,75.31 U$6.A
  Top 2.54: U$6.A 34.29,86.36 30.48,90.17 8.89,90.17 6.35,87.63 X13.1
BAT12_11.1V
  Top 2.54: X15.1 X14.2
BAT12_11V  (1 unrouted)
  Top 0.305: J3.1 R12.1
BAT23_22.2V
  Top 2.54: X14.1 X13.2
BAT23_22V
  Top 0.305: J2.1 R9.1
CAN_RX
  Top 0.305: IC4.36 104.64,22.85 105.28,23.5 U$1.4
CAN_TX
  Top 0.305: R3.1 110.35,27.24 U$1.1 112.14,27.3 112.78,26.67 112.78,23.24 111.76,22.23 108.58,22.23 108.03,21.68 IC4.33
CANH  (via drill 0.35)  (1 unrouted)
  Top 0.305: U$1.7 v124.21,26.04
  Bottom 0.305: v124.21,26.04 124.21,42.55 125.48,43.81 J5.2
CANL  (via drill 0.35)  (1 unrouted)
  Top 0.305: U$1.6 v123.06,24.77
  Bottom 0.305: v123.06,24.77 123.06,44.07 124.08,45.09 J5.3
GND  (via drill 0.35)
  Top 0.305: IC4.29 110.33,16.29 112.39,14.22 C13.2 | C15.2 101.89,25.49 102.23,25.15 IC4.39 | U$1.2 v107.95,26.04 | C12.2 127.6,21.59 C11.2 | C10.1 v89.15,27.56 | v89.15,27.56 C6.1 | U2.2 88.77,22.86 89.15,23.24 v89.15,27.56 | IC4.6 92.08,15.49 91.58,15 C7.2 | U$13.P$4 76.92,12.61 76.84,12.69 76.84,13.07 | 77.47,15.24 77.47,13.7 76.84,13.07 | U$13.P$2 75.62,12.61 75.62,14.42 75.86,14.66 76.6,14.66 76.84,14.42 76.84,13.07 | U$13.P$8 80.01,12.57 80.01,11.43
  Top 0.406: IC4.29 102.7,16.29 102.23,16.76 IC4.39
  Top 0.813: C2.- C27.- 46.99,81.72 IC1.3 IC1.5 | PAD11.1 PAD12.1 PAD13.1 PAD14.1
  other vias: 112.01,5.33 102.23,1.78 127.76,22.61 101.09,26.8 90.17,14.22 113.16,14.22 113.16,14.22 32.51,53.85 45.72,79.25 2.03,46.23 106.17,49.66 82.04,45.85 130.3,53.47 104.9,89.03 76.96,91.57 98.55,14.1 104.9,17.91 104.9,14.1 150.5,31.37 71.12,14.22 80.01,10.41
  pour Bottom (isolate 0.305): 80.01,0 160.02,0 160.02,38.1 80.01,38.1
  pour Top (isolate 0.305): 80.01,0 160.02,0 160.02,38.1 80.01,38.1
  pour Bottom (isolate 0.813): 0,0 80.01,0 80.01,38.1 160.02,38.1 160.02,100.33 0,100.33
  pour Top (isolate 0.813): 0,0 80.01,0 80.01,38.1 160.02,38.1 160.02,100.33 0,100.33
GND_POW  (2 unrouted)
  Top 0.61: LM2678T-12.4 68.58,81.28
  Top 0.813: LM2678S_ADJ.4 92.71,81.28 | R15.2 6.35,48.26
  Top 1.016: 120.65,82.98 120.65,80.01 119.38,81.28 C4.- 118.11,81.28
  Top 1.27: C1.- 120.65,82.98 IC2.3 IC2.5 | C23.2 C24.2 C25.2 92.71,81.28 C26.- | J6.4 139.06,60.33 | 139.06,46.35 J5.4 | X11.2 X10.2 X9.2
  Top 2.54: C16.- 68.58,66.04 | 68.58,66.04 C21.- | C19.- C28.- | C30.- C18.- | C29.- 68.58,81.28 C20.- | 69.85,38.1 71.12,39.37 U$3.A 71.12,48.26 68.58,50.8 68.58,66.04 | 92.71,40.64 U$2.A 92.71,53.34 90.17,55.88 90.17,64.77 91,65.61 C26.- | 139.06,60.33 137.16,58.42 137.16,48.26 139.06,46.35 | 116.84,38.1 120.65,41.91 120.65,57.15 | 120.65,80.01 120.65,57.15 | U$5.A 118.11,59.69 120.65,57.15 | 22.86,38.1 17.78,33.02 C5.- 16.51,22.86 X2.2 16.51,5.08 19.05,2.54 25.4,2.54 | 25.4,2.54 40.64,2.54 43.18,5.08 X3.2 | X4.2 28.42,5.56 25.4,2.54
  Top 5.08: X15.2 6.35,48.26 6.35,40.64 8.89,38.1 22.86,38.1 69.85,38.1 90.17,38.1 | 68.58,81.28 68.58,66.04 | 92.71,40.64 90.17,38.1 | 139.06,46.35 130.81,38.1 116.84,38.1 90.17,38.1
  Bottom 1.27: X9.2 133.35,88.9 IC2.5
  Bottom 2.54: IC2.5 124.05,78.74 126.59,76.2 X1.2
N$1
  Top 0.305: ON1.A R5.2
N$2
  Top 0.406: ON.A R6.1 R1.1
N$4
  Top 0.305: U$13.P$15 75.54,18.64 75.54,18.1 75.22,17.78 54.1,17.78 53.34,17.02 R9.2
N$5
  Top 0.305: IC4.7 93.81,14.69 93.34,14.22 C7.1
N$6
  Top 0.305: U$13.P$13 76.84,18.64 76.84,17.82 75.6,16.59 59.69,16.59 58.42,15.32 R11.2
N$7
  Top 1.016: LM2678S_ADJ.6 95.57,94.3 R8.2 R7.1
N$8
  Top 0.305: U$1.8 115.14,29.07 R2.2
N$9
  Top 1.016: IC2.2 118.95,87.2 115.57,83.82 115.57,72.39 | 115.57,72.39 115.57,67.31 U$11.1 | U$5.C 113.03,74.93 115.57,72.39
N$11
  Top 1.016: LM2678T-12.1 64.77,86.78 C17.2 63.5,84.67 63.5,55.88 | 63.5,55.88 U$9.1 | U$3.C 63.5,45.72 63.5,55.88
N$12
  Top 0.813: U$4.C 44.45,55.88 U$10.1 44.45,74.93 40.64,78.74 40.64,82.55 45.29,87.2 IC1.2
N$13
  Top 1.016: LM2678S_ADJ.3 91.44,86.78 C22.1
N$14
  Top 1.016: LM2678T-12.3 67.31,86.78 C17.1
N$15
  Top 0.305: U$13.P$12 77.49,18.64 77.49,17.68 75.84,16.03 67.31,16.03 64.77,13.49 R12.2
N$16
  Top 1.016: U$2.C 86.36,48.26 U$8.1 86.36,76.2 87.63,77.47 87.63,85.09 | 87.63,85.09 87.63,87.63 LM2678S_ADJ.1 | C22.2 88.9,86.36 87.63,85.09
N$17
  Top 1.016: 96.65,81.41 C25.1 | U$12.E 107.95,80.01 105.41,77.47 99.06,77.47 96.65,75.06 C23.1
  Top 1.27: 96.65,81.41 C24.1 C23.1 96.65,63.63 U$8.2
  Bottom 2.54: U$8.2 93.98,55.88 91.44,53.34 80.01,53.34 73.66,46.99 73.66,29.21 69.85,25.4 41.91,25.4 38.1,21.59 X3.1
N$18
  Top 0.813: U$6.B2 D5.A 31.58,50.97 U$7.3
N$19
  Top 1.016: U$12.S 102.87,83.82 100.33,86.36 R7.2
N$20
  Top 0.305: U$13.P$1 68.45,12.57 67.31,11.43 R13.2
N$21
  Top 0.305: U$13.P$14 76.19,18.64 76.19,17.96 75.37,17.14 57.91,17.14 55.88,15.11 R10.2
N$22
  Top 0.305: R14.2 70.17,10.16 76.2,10.16 77.53,11.49 U$13.P$5
OSC1
  Top 0.305: IC4.30 111.18,17.09 112.78,15.49 123.83,15.49 124.84,16.51 Q1.1 126.53,19.72 C11.1
OSC2
  Top 0.305: IC4.31 115.05,17.89 Q1.2 115.1,18.12 C12.1
PGC
  Top 0.305: J4.5 139.06,18.41 137.16,16.51 137.16,11.43 135.89,10.16 PAD6.1 133.6,10.16 133.1,10.67 107.21,10.67 IC4.22
PGD
  Top 0.254: 142.88,17.14 J4.4
  Top 0.305: 142.88,17.14 140.34,17.14 139.7,16.51 139.7,8.89 138.43,7.62 PAD5.1 132.46,9.78 109.09,9.78 108.84,9.78 108.58,9.78 107.06,8.26 105.79,8.26 105.44,8.61 IC4.21
PWM1L2/RP13/RB13
  Top 0.305: IC4.11 95.1,10.16 R5.1
PWM2H1/RP22
  Top 0.305: U$13.P$9 96.42,18.68 IC4.2
PWM2L1/RP23/RC7
  Top 0.305: IC4.3 79.88,17.89 79.85,17.86 79.11,17.86 78.87,18.1 78.87,18.64 U$13.P$10
RA7  (via drill 0.35)
  Top 0.305: IC4.13 99.03,7.59 97.79,6.35 83.82,6.35 82.55,7.62 v82.55,13.97 | v82.55,22.86 39.37,22.86 38.1,24.13 v38.1,33.02 | v38.1,45.72 38.1,50.8 36.51,52.39 U$7.1
  Bottom 0.305: v82.55,13.97 v82.55,22.86 | v38.1,33.02 v38.1,45.72
RESET
  Top 0.305: IC4.18 103.03,5.55 104.97,3.62 R4.2 111.22,3.62 RESET.2 RESET.1 141.26,2.83 143.51,5.08 J4.1
RP2/RB2/AN4
  Top 0.305: IC4.23 133.41,11.49 PAD3.1
RP3/RB3/AN5
  Top 0.305: IC4.24 131.67,12.29 PAD4.1
RP20/TX/SDO
  Top 0.305: IC4.37 103.83,29.79 104.78,30.73 126.36,30.73 127.64,29.46 127.64,25.65 128.4,24.89 149.86,24.89 151.13,26.16 151.13,29.72 151.89,30.48 SL2.3
RP21/RC5/RX/SS
  Top 0.305: IC4.38 103.03,31.53 103.5,32 129.29,32 130.3,30.99 130.3,27.18 131.06,26.42 148.08,26.42 148.97,27.3 148.97,32 149.99,33.02 SL2.2
RP24/RC8
  Top 0.305: U$13.P$11 78.22,18.64 78.22,17.96 79.09,17.09 IC4.4
RP25/RC9
  Top 0.305: IC4.5 78.65,16.29 78.22,15.86 78.22,12.61 U$13.P$6
V+
  Top 2.54: C29.+ C18.+ C28.+ C21.+ 77.03,55.45 76.2,54.61 U$9.2
  Bottom 2.54: U$9.2 66.04,48.26 29.21,48.26 24.92,43.97 X4.1